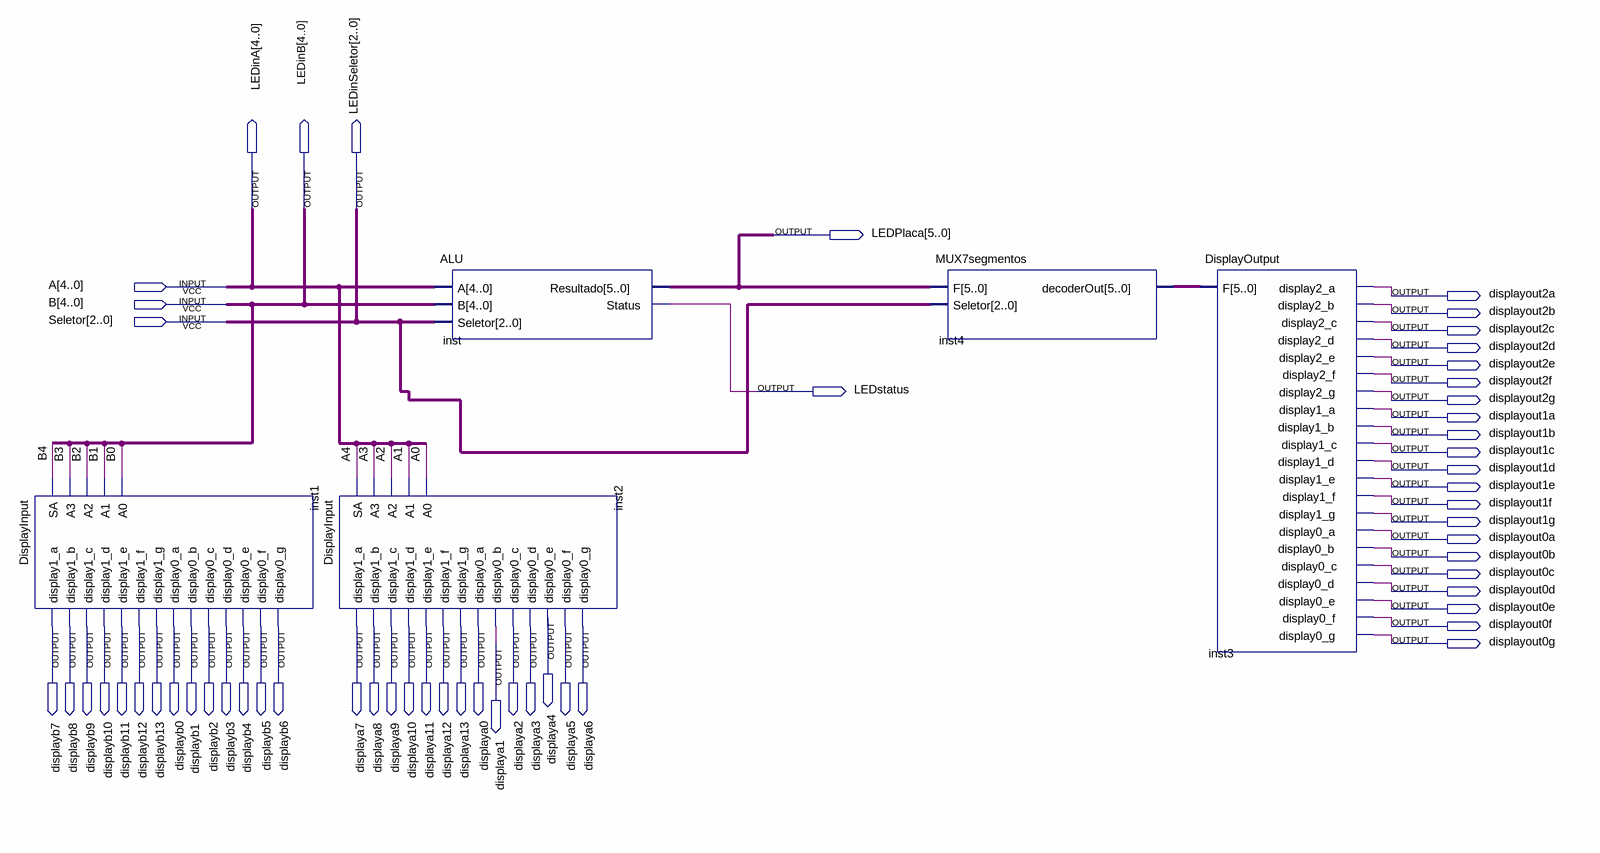
[diagram p0: schematic sheet]
// Quartus schematic ALUcomLEDS.bdf as structural Verilog: 5 symbols, 57 pins
module ALUcomLEDS (
  input  [4:0] A,
  input  [4:0] B,
  input  [2:0] Seletor,
  output [4:0] LEDinA,
  output [4:0] LEDinB,
  output [2:0] LEDinSeletor,
  output [5:0] LEDPlaca,
  output displayout2a,
  output displayout2b,
  output displayout2c,
  output displayout2d,
  output displayout2e,
  output displayout2f,
  output LEDstatus,
  output displayout2g,
  output displayout1a,
  output displayout1b,
  output displayout1c,
  output displayout1d,
  output displayout1e,
  output displayout1f,
  output displayout1g,
  output displayout0a,
  output displayout0b,
  output displayout0c,
  output displayout0d,
  output displayout0e,
  output displaya4,
  output displayb7,
  output displayb8,
  output displayb9,
  output displayb10,
  output displayb11,
  output displayb12,
  output displayb13,
  output displayb0,
  output displayb1,
  output displayb2,
  output displayb3,
  output displayb4,
  output displayb5,
  output displayb6,
  output displaya7,
  output displaya8,
  output displaya9,
  output displaya10,
  output displaya11,
  output displaya12,
  output displaya13,
  output displaya0,
  output displaya2,
  output displaya3,
  output displaya5,
  output displaya6,
  output displayout0f,
  output displaya1,
  output displayout0g
);

  wire [5:0] inst4_decoderout;

  DisplayInput inst1 (
    .SA(B[4]), .A3(B[3]), .A2(B[2]), .A1(B[1]), .A0(B[0]), .display1_a(displayb7), .display1_b(displayb8),
    .display1_c(displayb9), .display1_d(displayb10), .display1_e(displayb11), .display1_f(displayb12),
    .display1_g(displayb13), .display0_a(displayb0), .display0_b(displayb1), .display0_c(displayb2),
    .display0_d(displayb3), .display0_e(displayb4), .display0_f(displayb5), .display0_g(displayb6));
  DisplayInput inst2 (
    .SA(A[4]), .A3(A[3]), .A2(A[2]), .A1(A[1]), .A0(A[0]), .display1_a(displaya7), .display1_b(displaya8),
    .display1_c(displaya9), .display1_d(displaya10), .display1_e(displaya11), .display1_f(displaya12),
    .display1_g(displaya13), .display0_a(displaya0), .display0_b(displaya1), .display0_c(displaya2),
    .display0_d(displaya3), .display0_e(displaya4), .display0_f(displaya5), .display0_g(displaya6));
  ALU inst (.A(A), .B(B), .Seletor(Seletor), .Resultado(LEDPlaca), .Status(LEDstatus));
  MUX7segmentos inst4 (.F(LEDPlaca), .Seletor(Seletor), .decoderOut(inst4_decoderout));
  DisplayOutput inst3 (
    .F(inst4_decoderout), .display2_a(displayout2a), .display2_b(displayout2b), .display2_c(displayout2c),
    .display2_d(displayout2d), .display2_e(displayout2e), .display2_f(displayout2f),
    .display2_g(displayout2g), .display1_a(displayout1a), .display1_b(displayout1b),
    .display1_c(displayout1c), .display1_d(displayout1d), .display1_e(displayout1e),
    .display1_f(displayout1f), .display1_g(displayout1g), .display0_a(displayout0a),
    .display0_b(displayout0b), .display0_c(displayout0c), .display0_d(displayout0d),
    .display0_e(displayout0e), .display0_f(displayout0f), .display0_g(displayout0g));

  assign LEDinA = A;
  assign LEDinB = B;
  assign LEDinSeletor = Seletor;
endmodule
